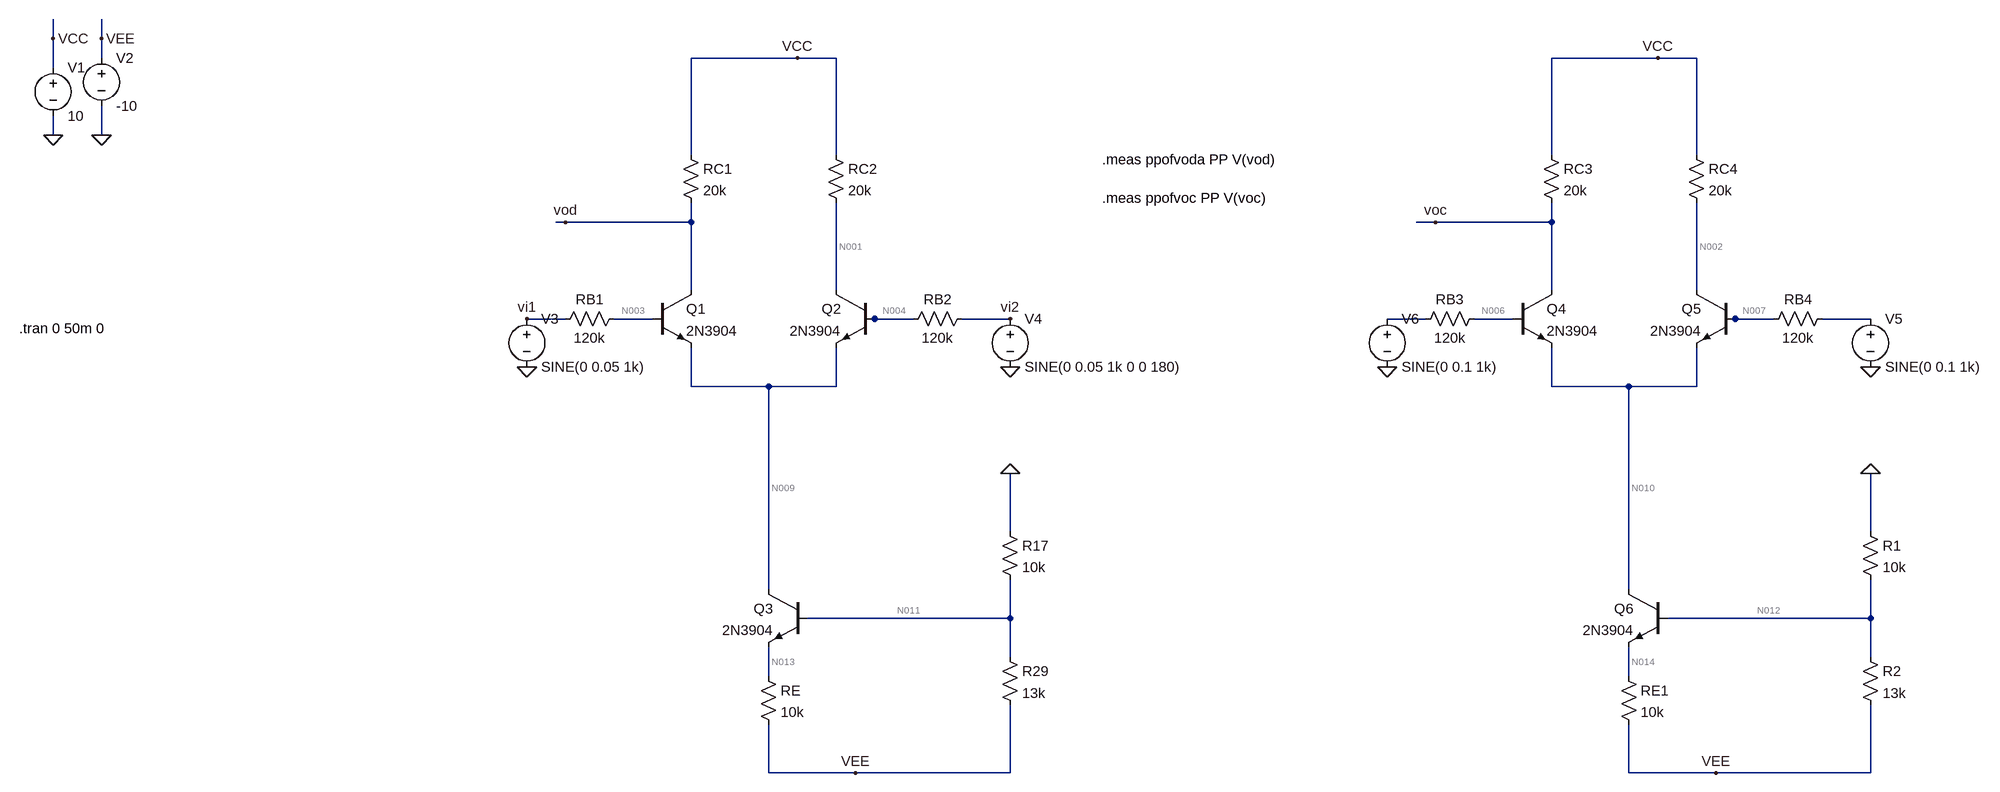
[diagram p0: schematic 4_36.asc]
4_36.asc, the LTspice schematic file:
Version 4
SHEET 1 2688 2124
WIRE -688 768 -688 736
WIRE -608 768 -608 736
WIRE -608 800 -608 768
WIRE 544 800 368 800
WIRE 608 800 544 800
WIRE 1968 800 1792 800
WIRE 2032 800 1968 800
WIRE -688 816 -688 768
WIRE -688 928 -688 896
WIRE -608 928 -608 880
WIRE 368 960 368 800
WIRE 608 960 608 800
WIRE 1792 960 1792 800
WIRE 2032 960 2032 800
WIRE 160 1072 144 1072
WIRE 368 1072 368 1040
WIRE 368 1072 160 1072
WIRE 1600 1072 1568 1072
WIRE 1792 1072 1792 1040
WIRE 1792 1072 1600 1072
WIRE 368 1184 368 1072
WIRE 608 1184 608 1040
WIRE 1792 1184 1792 1072
WIRE 2032 1184 2032 1040
WIRE 160 1232 96 1232
WIRE 304 1232 240 1232
WIRE 672 1232 656 1232
WIRE 736 1232 672 1232
WIRE 896 1232 816 1232
WIRE 1584 1232 1520 1232
WIRE 1728 1232 1664 1232
WIRE 2096 1232 2080 1232
WIRE 2160 1232 2096 1232
WIRE 2320 1232 2240 1232
WIRE 368 1344 368 1280
WIRE 496 1344 368 1344
WIRE 608 1344 608 1280
WIRE 608 1344 496 1344
WIRE 1792 1344 1792 1280
WIRE 1920 1344 1792 1344
WIRE 2032 1344 2032 1280
WIRE 2032 1344 1920 1344
WIRE 896 1584 896 1488
WIRE 2320 1584 2320 1488
WIRE 496 1680 496 1344
WIRE 1920 1680 1920 1344
WIRE 896 1728 896 1664
WIRE 896 1728 560 1728
WIRE 2320 1728 2320 1664
WIRE 2320 1728 1984 1728
WIRE 896 1792 896 1728
WIRE 2320 1792 2320 1728
WIRE 496 1824 496 1776
WIRE 1920 1824 1920 1776
WIRE 496 1984 496 1904
WIRE 640 1984 496 1984
WIRE 896 1984 896 1872
WIRE 896 1984 640 1984
WIRE 1920 1984 1920 1904
WIRE 2064 1984 1920 1984
WIRE 2320 1984 2320 1872
WIRE 2320 1984 2064 1984
FLAG 544 800 VCC
FLAG 640 1984 VEE
FLAG 96 1232 vi1
FLAG 896 1232 vi2
FLAG -688 928 0
FLAG -608 928 0
FLAG -688 768 VCC
FLAG -608 768 VEE
FLAG 896 1312 0
FLAG 96 1312 0
FLAG 896 1488 0
FLAG 1968 800 VCC
FLAG 2064 1984 VEE
FLAG 2320 1312 0
FLAG 1520 1312 0
FLAG 2320 1488 0
FLAG 160 1072 vod
FLAG 1600 1072 voc
SYMBOL npn 304 1184 R0
SYMATTR InstName Q1
SYMATTR Value 2N3904
SYMBOL npn 672 1184 M0
SYMATTR InstName Q2
SYMATTR Value 2N3904
SYMBOL res 352 944 R0
SYMATTR InstName RC1
SYMATTR Value 20k
SYMBOL res 592 944 R0
SYMATTR InstName RC2
SYMATTR Value 20k
SYMBOL npn 560 1680 M0
SYMATTR InstName Q3
SYMATTR Value 2N3904
SYMBOL res 880 1568 R0
SYMATTR InstName R17
SYMATTR Value 10k
SYMBOL res 880 1776 R0
SYMATTR InstName R29
SYMATTR Value 13k
SYMBOL res 480 1808 R0
SYMATTR InstName RE
SYMATTR Value 10k
SYMBOL res 256 1216 R90
WINDOW 0 0 56 VBottom 2
WINDOW 3 32 56 VTop 2
SYMATTR InstName RB1
SYMATTR Value 120k
SYMBOL res 720 1248 R270
WINDOW 0 32 56 VTop 2
WINDOW 3 0 56 VBottom 2
SYMATTR InstName RB2
SYMATTR Value 120k
SYMBOL voltage -688 800 R0
WINDOW 123 0 0 Left 0
WINDOW 39 0 0 Left 0
SYMATTR InstName V1
SYMATTR Value 10
SYMBOL voltage -608 784 R0
WINDOW 123 0 0 Left 0
WINDOW 39 0 0 Left 0
SYMATTR InstName V2
SYMATTR Value -10
SYMBOL voltage 96 1216 R0
WINDOW 123 0 0 Left 0
WINDOW 39 0 0 Left 0
SYMATTR InstName V3
SYMATTR Value SINE(0 0.05 1k)
SYMBOL voltage 896 1216 R0
WINDOW 123 0 0 Left 0
WINDOW 39 0 0 Left 0
SYMATTR InstName V4
SYMATTR Value SINE(0 0.05 1k 0 0 180)
SYMBOL npn 1728 1184 R0
SYMATTR InstName Q4
SYMATTR Value 2N3904
SYMBOL npn 2096 1184 M0
SYMATTR InstName Q5
SYMATTR Value 2N3904
SYMBOL res 1776 944 R0
SYMATTR InstName RC3
SYMATTR Value 20k
SYMBOL res 2016 944 R0
SYMATTR InstName RC4
SYMATTR Value 20k
SYMBOL npn 1984 1680 M0
SYMATTR InstName Q6
SYMATTR Value 2N3904
SYMBOL res 2304 1568 R0
SYMATTR InstName R1
SYMATTR Value 10k
SYMBOL res 2304 1776 R0
SYMATTR InstName R2
SYMATTR Value 13k
SYMBOL res 1904 1808 R0
SYMATTR InstName RE1
SYMATTR Value 10k
SYMBOL res 1680 1216 R90
WINDOW 0 0 56 VBottom 2
WINDOW 3 32 56 VTop 2
SYMATTR InstName RB3
SYMATTR Value 120k
SYMBOL res 2144 1248 R270
WINDOW 0 32 56 VTop 2
WINDOW 3 0 56 VBottom 2
SYMATTR InstName RB4
SYMATTR Value 120k
SYMBOL voltage 2320 1216 R0
WINDOW 123 0 0 Left 0
WINDOW 39 0 0 Left 0
SYMATTR InstName V5
SYMATTR Value SINE(0 0.1 1k)
SYMBOL voltage 1520 1216 R0
WINDOW 123 0 0 Left 0
WINDOW 39 0 0 Left 0
SYMATTR InstName V6
SYMATTR Value SINE(0 0.1 1k)
TEXT -744 1248 Left 2 !.tran 0 50m 0
TEXT 1048 968 Left 2 !.meas ppofvoda PP V(vod)
TEXT 1048 1032 Left 2 !.meas ppofvoc PP V(voc)

The netlist it stands for:
* 4_36.asc
Q1 vod N003 N009 0 2N3904
Q2 N001 N004 N009 0 2N3904
RC1 VCC vod 20k
RC2 VCC N001 20k
Q3 N009 N011 N013 0 2N3904
R17 0 N011 10k
R29 N011 VEE 13k
RE N013 VEE 10k
RB1 N003 vi1 120k
RB2 N004 vi2 120k
V1 VCC 0 10
V2 VEE 0 -10
V3 vi1 0 SINE(0 0.05 1k)
V4 vi2 0 SINE(0 0.05 1k 0 0 180)
Q4 voc N006 N010 0 2N3904
Q5 N002 N007 N010 0 2N3904
RC3 VCC voc 20k
RC4 VCC N002 20k
Q6 N010 N012 N014 0 2N3904
R1 0 N012 10k
R2 N012 VEE 13k
RE1 N014 VEE 10k
RB3 N006 N005 120k
RB4 N007 N008 120k
V5 N008 0 SINE(0 0.1 1k)
V6 N005 0 SINE(0 0.1 1k)
.model NPN NPN
.model PNP PNP
.lib standard.bjt
.tran 0 50m 0
.meas ppofvoda PP V(vod)
.meas ppofvoc PP V(voc)
.backanno
.end

* Results of the author's LTspice run, read from the files saved beside the schematic
* Operating Point, zero values left out:
*   V(vod) = 5.025 V
*   V(n003) = -94.71 mV
*   V(n009) = -712.6 mV
*   V(n001) = 5.025 V
*   V(n004) = -94.71 mV
*   V(vcc) = 10 V
*   V(n011) = -4.357 V
*   V(n013) = -4.993 V
*   V(vee) = -10 V
*   V(voc) = 5.025 V
*   V(n006) = -94.71 mV
*   V(n010) = -712.6 mV
*   V(n002) = 5.025 V
*   V(n007) = -94.71 mV
*   V(n012) = -4.357 V
*   V(n014) = -4.993 V
*   Ic(Q6) = 499.1 µA
*   Ib(Q6) = 1.607 µA
*   Ie(Q6) = -500.7 µA
*   Ic(Q5) = 248.7 µA
*   Ib(Q5) = 789.2 nA
*   Ie(Q5) = -249.5 µA
*   Ic(Q4) = 248.7 µA
*   Ib(Q4) = 789.2 nA
*   Ie(Q4) = -249.5 µA
*   Ic(Q3) = 499.1 µA
*   Ib(Q3) = 1.607 µA
*   Ie(Q3) = -500.7 µA
*   Ic(Q2) = 248.7 µA
*   Ib(Q2) = 789.2 nA
*   Ie(Q2) = -249.5 µA
*   Ic(Q1) = 248.7 µA
*   Ib(Q1) = 789.2 nA
*   Ie(Q1) = -249.5 µA
*   I(Rb4) = -789.2 nA
*   I(Rb3) = -789.2 nA
*   I(Re1) = 500.7 µA
*   I(R2) = 434.1 µA
*   I(R1) = 435.7 µA
*   I(Rc4) = 248.7 µA
*   I(Rc3) = 248.7 µA
*   I(Rb2) = -789.2 nA
*   I(Rb1) = -789.2 nA
*   I(Re) = 500.7 µA
*   I(R29) = 434.1 µA
*   I(R17) = 435.7 µA
*   I(Rc2) = 248.7 µA
*   I(Rc1) = 248.7 µA
*   I(V6) = -789.2 nA
*   I(V5) = -789.2 nA
*   I(V4) = -789.2 nA
*   I(V3) = -789.2 nA
*   I(V2) = 1.87 mA
*   I(V1) = -995 µA
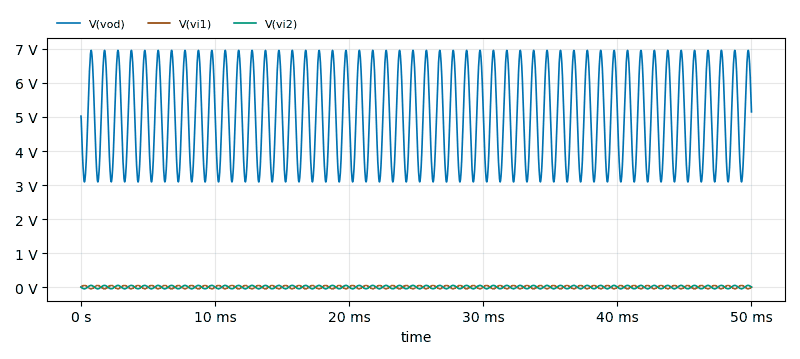
[diagram p1: Transient Analysis of 4_36.asc, plotted from the saved traces]
* Transient Analysis, 1 run:
*   V(vod): min 3.092 V, max 6.958 V, average 5.025 V, rms 5.206 V, last 5.15 V
*   V(vi1): min -50 mV, max 50 mV, average 84.28 nV, rms 35.45 mV, last 0 V
*   V(vi2): min -50 mV, max 50 mV, average -84.28 nV, rms 35.45 mV, last 0 V
* From the log:
*   ppofvoda: PP(v(vod))=3.86648 FROM 0 TO 0.05
*   ppofvoc: PP(v(voc))=6.77109e-005 FROM 0 TO 0.05